# Altium schematic sheet sd.SchDoc
size A
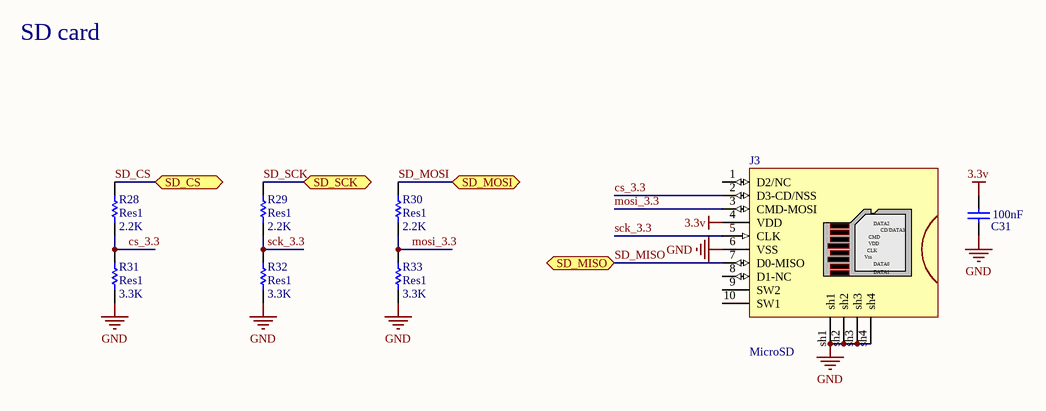
[diagram p0: sd.SchDoc]

## Parts
C31  value 100nF  [CAP 1206 (3216X15L)]  (hidden comment: Cap)
J3  MicroSD  [SD_card]
R28  Res1  value 2.2K  [RES 1206 (3216X08L)]
R29  Res1  value 2.2K  [RES 1206 (3216X08L)]
R30  Res1  value 2.2K  [RES 1206 (3216X08L)]
R31  Res1  value 3.3K  [RES 1206 (3216X08L)]
R32  Res1  value 3.3K  [RES 1206 (3216X08L)]
R33  Res1  value 3.3K  [RES 1206 (3216X08L)]

## Ports
SD_CS (bidir), SD_MISO (bidir), SD_MOSI (bidir), SD_SCK (bidir)

## Nets
3.3v: C31.2 J3.4(VDD)
GND: C31.1 J3.6(VSS) J3.sh1 J3.sh2 J3.sh3 J3.sh4 R31.1 R32.1 R33.1
cs_3.3: J3.2(D3-CD/NSS) R28.1 R31.2
mosi_3.3: J3.3(CMD-MOSI) R30.1 R33.2
sck_3.3: J3.5(CLK) R29.1 R32.2
SD_CS: R28.2 ; port SD_CS
SD_MISO: J3.7(D0-MISO) ; port SD_MISO
SD_MOSI: R30.2 ; port SD_MOSI
SD_SCK: R29.2 ; port SD_SCK

Not connected (* = marked no-connect by the designer): J3 1(D2/NC) 8(D1-NC) 9(SW2) 10(SW1)

## Notes on the sheet
- SD card
- (in symbol MicroSD) DATA2; CD/DATA3; CMD; Vss; DATA0; DATA1

## Library data of the parts
C31 = Cap ceramic: CAP-100Nf
J3 = MicroSD: MicroSD_altium designer (M.Hariri); Created by:: altium designer (M.Hariri); VALUE: MicroSD
R28-R33 = Res1: Resistor; Published: 8-Jun-2000; LatestRevisionDate: 17-Jul-2002; LatestRevisionNote: Re-released for DXP Platform.; PackageReference: AXIAL-0.3; Publisher: Altium Limited; PackageDescription: Axial Device, Thru-Hole; 2 Leads; 0.3 in Pin Spacing